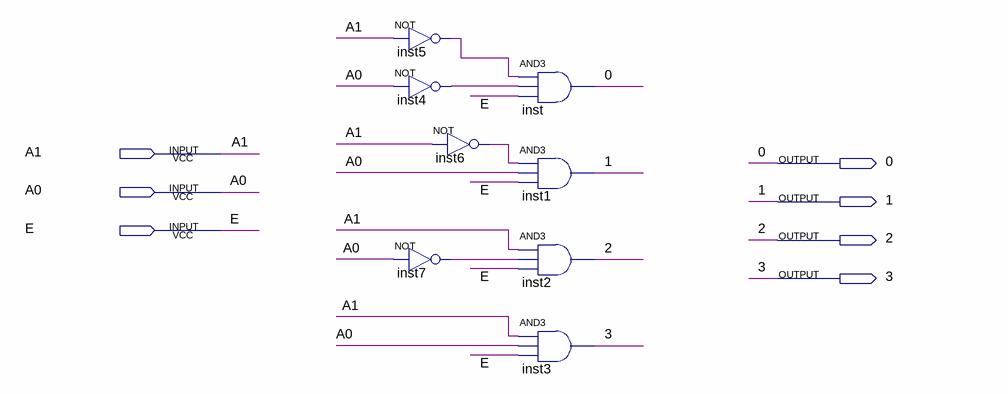
[diagram p0: schematic sheet]
// Quartus schematic 2to4decoder.bdf as structural Verilog: 8 symbols, 7 pins
module \2to4decoder  (
  input  A1,
  input  A0,
  input  E,
  output \0 ,
  output \1 ,
  output \2 ,
  output \3 
);

  wire inst4_out, inst5_out, inst6_out, inst7_out;

  not inst5 (inst5_out, A1);
  not inst4 (inst4_out, A0);
  not inst6 (inst6_out, A1);
  not inst7 (inst7_out, A0);
  and inst (\0 , inst5_out, inst4_out, E);
  and inst1 (\1 , inst6_out, A0, E);
  and inst2 (\2 , A1, inst7_out, E);
  and inst3 (\3 , A1, A0, E);
endmodule
